# Altium schematic sheet socket_2bridges.SchDoc
size A4; SheetNumber: 2; SheetTotal: 2
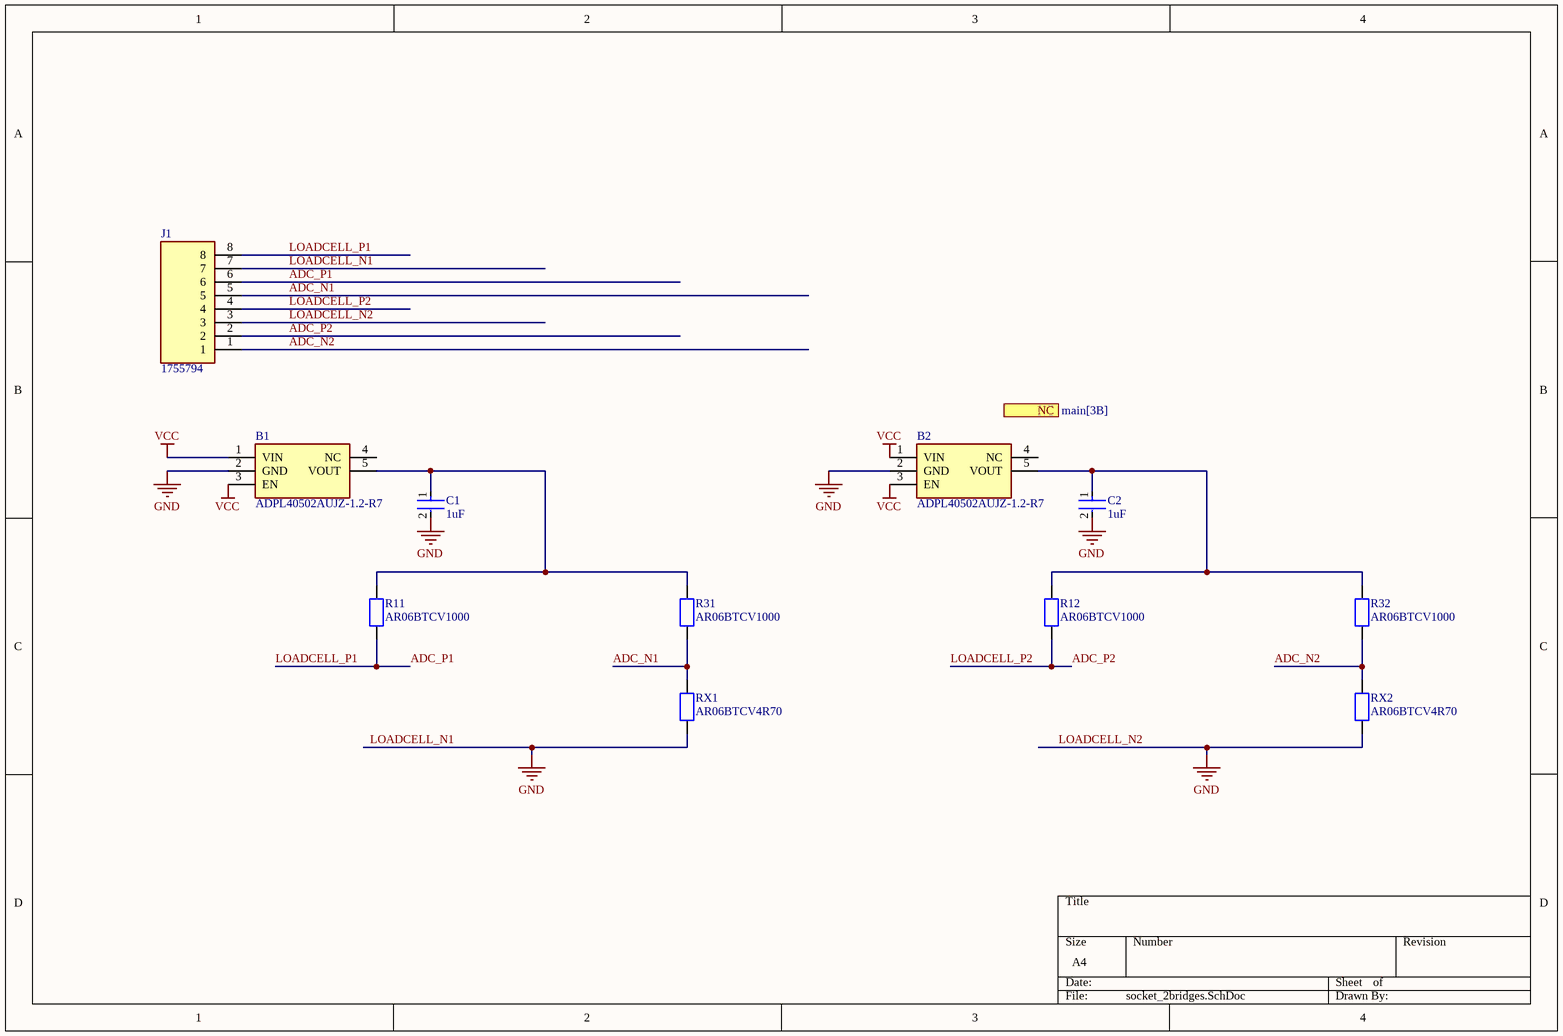
[diagram p0: socket_2bridges.SchDoc]

## Parts
B1  ADPL40502AUJZ-1.2-R7  [SOT95P280X100-5N]
B2  ADPL40502AUJZ-1.2-R7  [SOT95P280X100-5N]
C1  1uF  [FP-CGA5L-0_3-0_1-IPC_A]
C2  1uF  [FP-CGA5L-0_3-0_1-IPC_A]
J1  1755794  [1755794]
R11  AR06BTCV1000  [AR06]
R12  AR06BTCV1000  [AR06]
R31  AR06BTCV1000  [AR06]
R32  AR06BTCV1000  [AR06]
RX1  AR06BTCV4R70  [AR06]
RX2  AR06BTCV4R70  [AR06]

## Ports
NC (see main[3B])

## Nets
LOADCELL_N1: B1.2(GND) B2.2(GND) C1.2 C2.2 J1.3 J1.7 RX1.1 RX2.1  [also labelled GND, LOADCELL_N2]
VCC: B1.1(VIN) B1.3(EN) B2.1(VIN) B2.3(EN)
ADC_N1: J1.5 R31.1 RX1.2
ADC_N2: J1.1 R32.1 RX2.2
ADC_P1: J1.6 J1.8 R11.1  [also labelled LOADCELL_P1]
ADC_P2: J1.2 J1.4 R12.1  [also labelled LOADCELL_P2]
NetB1_5: B1.5(VOUT) C1.1 R11.2 R31.2
NetB2_5: B2.5(VOUT) C2.1 R12.2 R32.2

Not connected (* = marked no-connect by the designer): B1 4(NC); B2 4(NC)

## Library data of the parts
B1 B2 = ADPL40502AUJZ-1.2-R7: Low Noise, 200mA, CMOS Linear Regulator; Manufacturer_Name: Analog Devices; Geometry.Height: 1mm; Mouser Part Number: *; Mouser Price/Stock: *; Manufacturer_Part_Number: ADPL40502AUJZ-1.2-R7; Datasheet Link: https://www.analog.com/ADPL40502/datasheet
C1 C2 = CMP-08246-001699-1: Cap Ceramic 1uF 25V X7R 10% Pad SMD 1206 +125°C Automotive T/R; Max Operating Temperature: 125°C; Weight: 0.000571oz; Package Quantity: 2000; Width: 1.6mm; Voltage Rating: 25V; REACH SVHC: No SVHC; Height: 1.6mm; Min Operating Temperature: -55°C; Mount: Surface Mount; Case/Package: 1206; Ratings: AEC-Q200; Case Code (Imperial): 1206; Capacitance: 1uF; Termination: SMD/SMT; Length: 3.2mm; Depth: 1.6mm; Thickness: 0.075inch; Packaging: Tape and Reel; Tolerance: 10%; Dielectric: X7R; Case Code (Metric): 3216; Voltage Rating (DC): 25V; Composition: Ceramic
J1 = 1755794: Connector; Manufacturer_Name: Phoenix Contact; Datasheet Link: http://www.phoenixcontact.com/de/produkte/1755794/pdf; Height: 12.15mm; Manufacturer_Part_Number: 1755794; Mouser Part Number: 651-1755794; Mouser Price/Stock: https://www.mouser.co.uk/ProductDetail/Phoenix-Contact/1755794?qs=wd%252Bw3mUqFrk%2FIOZ4HDo8lg%3D%3D; Arrow Part Number: 1755794; Arrow Price/Stock: https://www.arrow.com/en/products/1755794/phoenix-contact?utm_currency=USD&region=nac